# EAGLE board generation_board_v5 (EAGLE 8.4.2)
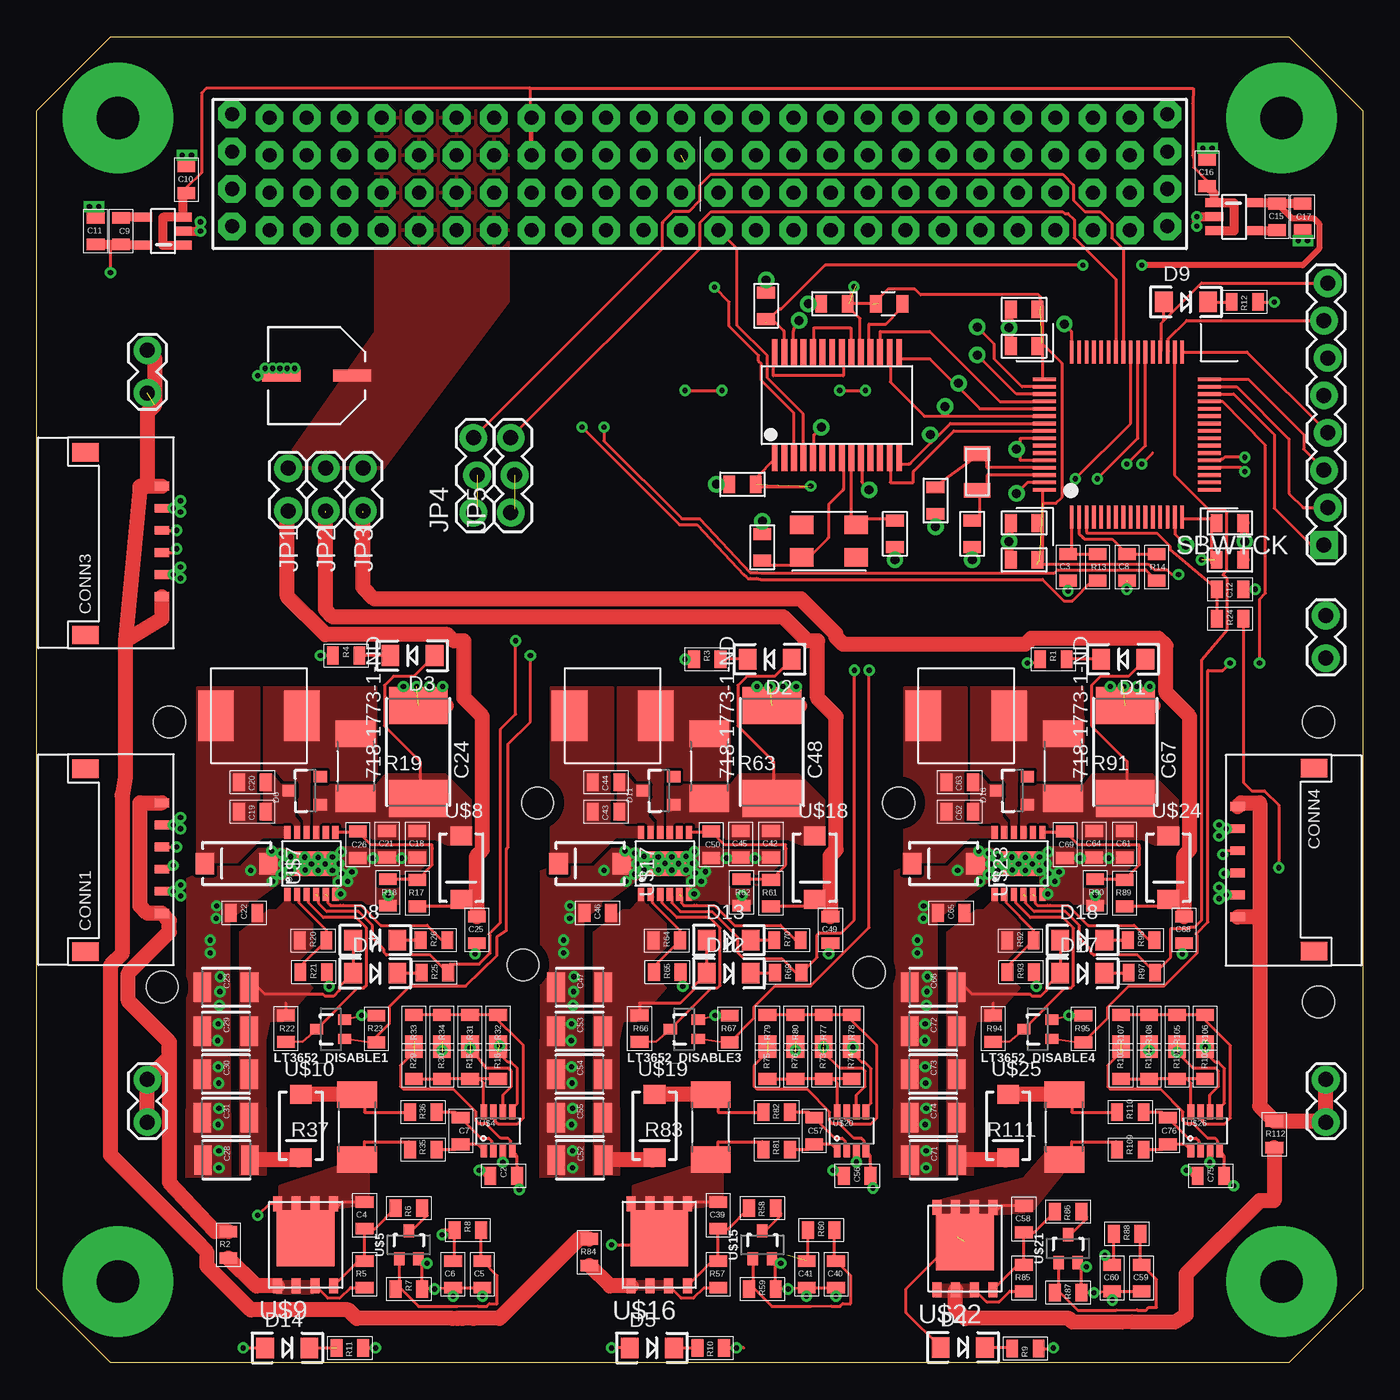
[diagram p2: board, top side]
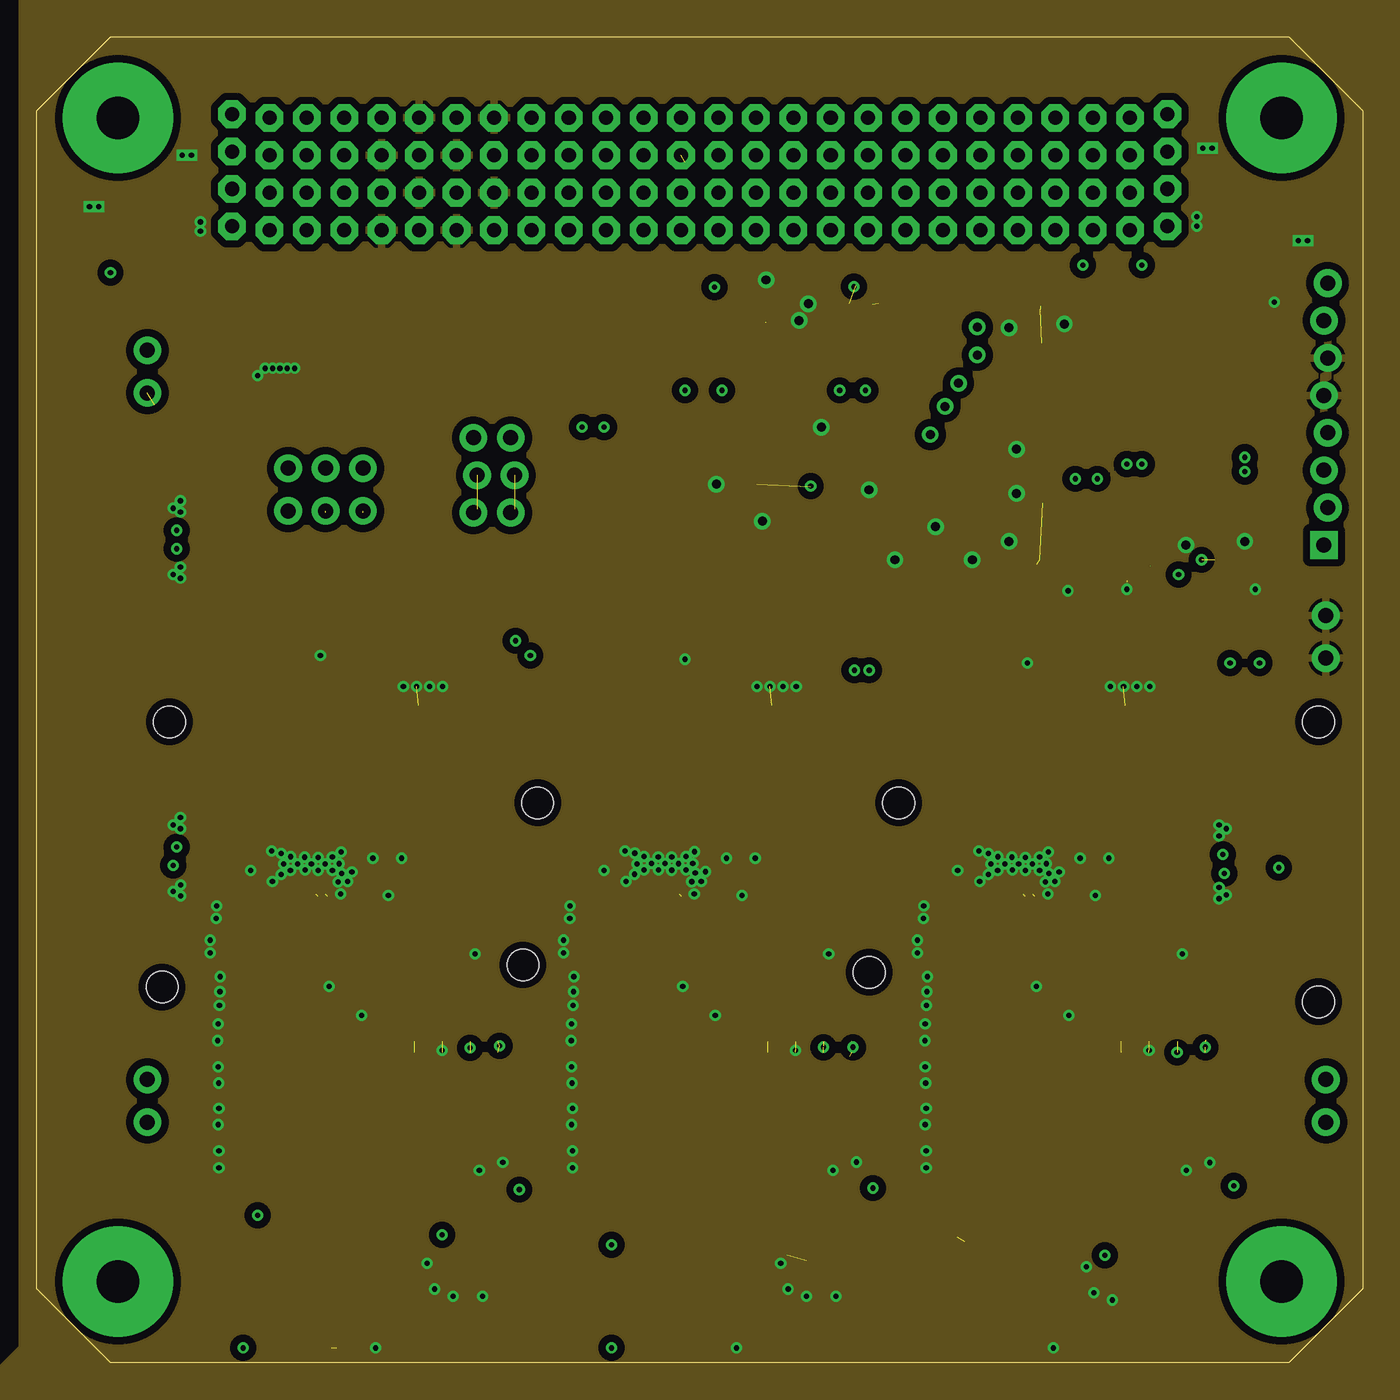
[diagram p3: board, inner layer GND2]
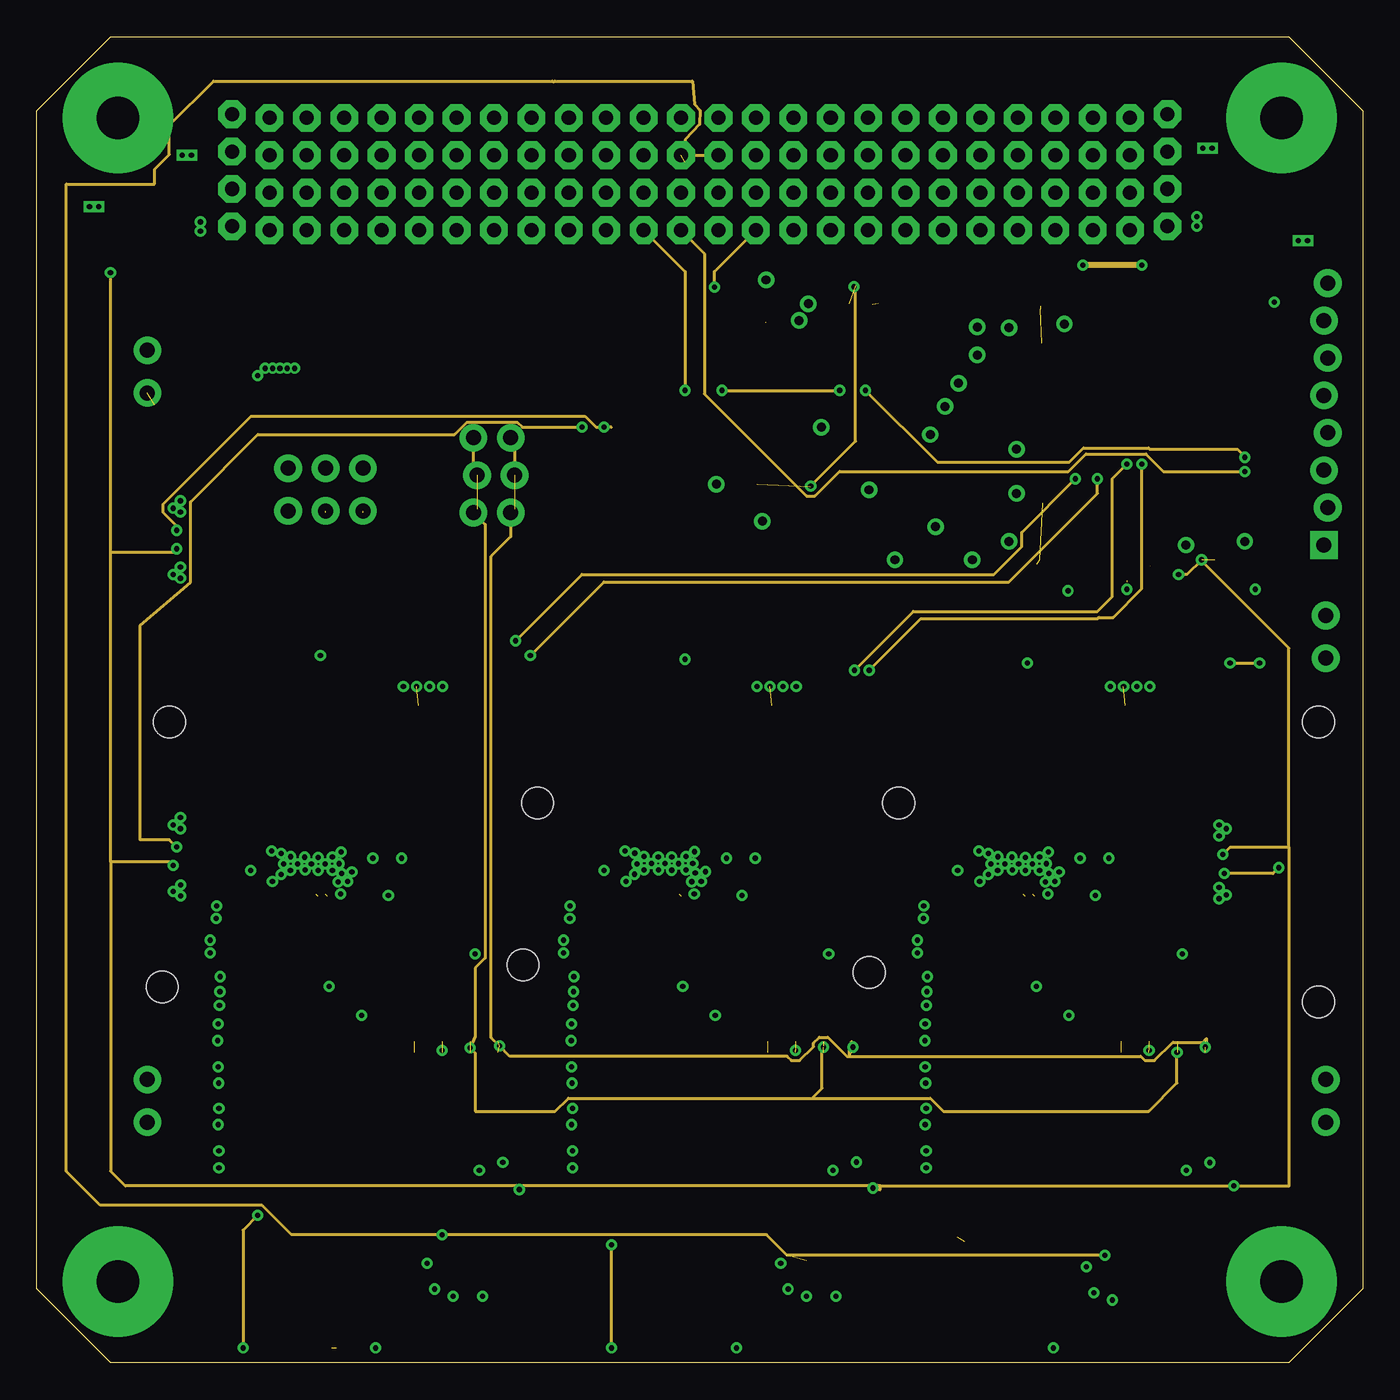
[diagram p4: board, inner layer Route3]
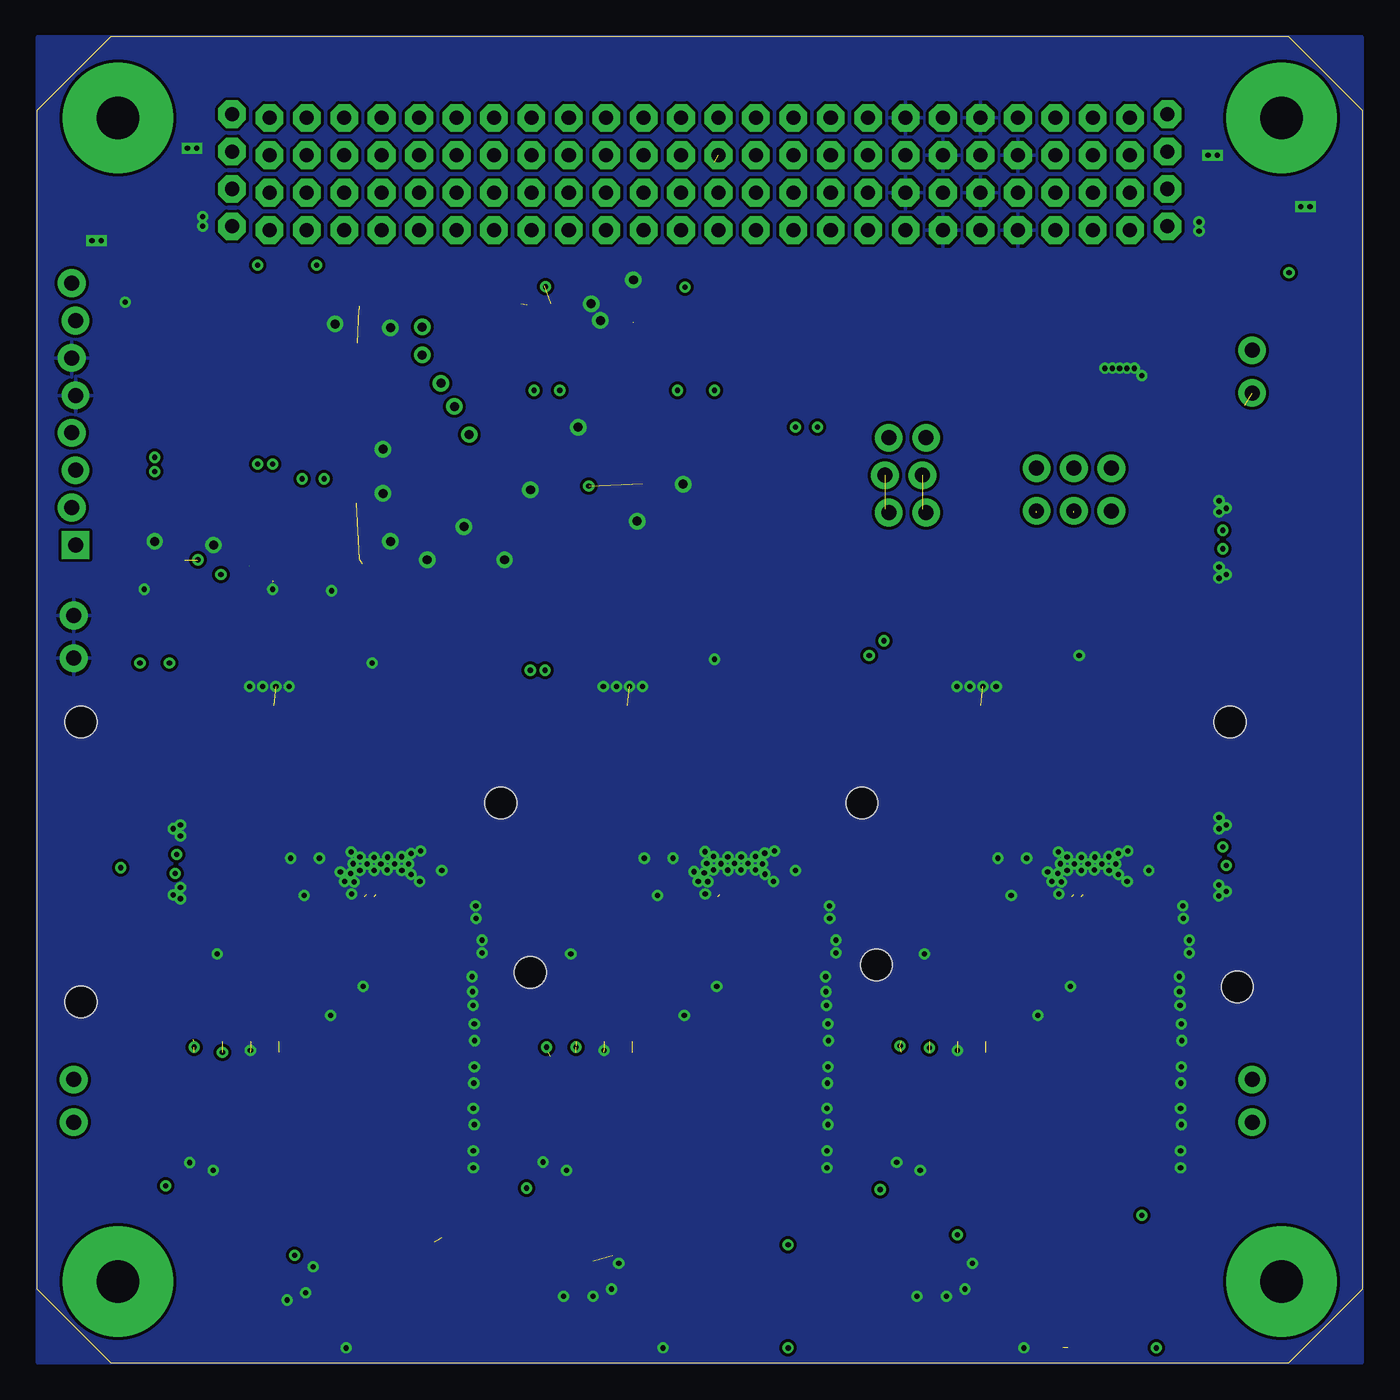
[diagram p5: board, bottom side, seen from below]

Size 90 x 90 mm. Coordinates in mm from the lower left corner, seen from the top.
Copper layers (1*2*3*16): Top 0.035mm / dielectric 1.5mm / GND2 0.035mm / dielectric 0.15mm / Route3 0.035mm / dielectric 0.2mm / GND 0.035mm
Design rules "default *": minimum track width 6mil, minimum drill 0.35mm, track to track 8mil, track to pad 8mil, pad to pad 8mil, via to via 8mil, smd to smd 0mil, copper to edge 0mil, drill to drill 6mil, minimum pad ring 10mil, minimum via ring 8mil, stop-mask expansion 4mil, vias tented up to drill 0mil, thermal gap 10mil
Net classes: 0 default: width 0.254 mm, drill 0.254 mm, clearance 0.152 mm

## Footprints (pad centres in the part's own frame; a part is rotated, then mirrored left to right if it is on the bottom)
MSP-CAN_BLOCK = smd 1.2 x 0.8: 1 -6,6.08; 2 -6,7.88; 3 -8.5,6.08; 4 -8.5,7.88; 9 -8.5,-6.08; 10 -8.5,-7.88; 11 -6,-6.08; 12 -6,-7.88; 13 8.5,6.08; 14 8.5,7.88; 15 6,6.08; 16 6,7.88; 23 8.875,18.955; 24 8.875,20.755; 25 8.875,17.045; 26 8.875,15.245; 27 -3.375,25.205; 28 -3.375,27.005 | smd 1 x 0.25: 3.3V@CAN1 -3.375,25.125; 3.3V@CAN2 8.875,18.875; 3.3V@MSP1 8.501,5.884; 3.3V@MSP2 -8.533,-5.962; 3.3V_ANALOG@MSP2 -8.482,5.904 | smd 0.8 x 1.2: 5 -5.83,10.5; 6 -7.63,10.5; 7 -3.58,13; 8 -5.38,13; 17 -8.545,24.75; 18 -6.745,24.75; 19 -5.83,15.75; 20 -7.63,15.75; 21 7.83,24.5; 22 9.63,24.5 | smd 0.25 x 1: 5V 7.65,24.5 | smd 1.75 x 0.4: CANH -1.6,21.96; CANL -1.6,22.61; P$65 -1.6,23.91; P$66 -1.6,23.26; P$69 -1.6,21.31; P$70 -1.6,20.66; P$71 -1.6,20.01; P$72 -1.6,19.36; P$73 -1.6,18.71; P$74 -1.6,18.06; P$75 -1.6,17.41; P$76 -1.6,16.76; P$77 -1.6,16.11; P$78 -1.6,15.46; P$79 5.6,15.46; P$80 5.6,16.11; P$81 5.6,16.76; P$82 5.6,17.41; P$83 5.6,18.06; P$84 5.6,18.71; P$85 5.6,19.36; P$86 5.6,20.01; P$87 5.6,20.66; P$88 5.6,21.31; P$89 5.6,21.96; P$90 5.6,22.61; P$91 5.6,23.26; P$92 5.6,23.91 | drill 0.61: GND@1 -3.375,27.875; GND@2 -5.875,24.75; GND@3 -3.75,17.5; GND@4 0.5,20.75; GND@5 -8.5,15.75; GND@7 -8.5,10.5; GND@8 -7.25,8; GND@9 -4,7.5; GND@10 -1,7.5; GND@11 7.75,22.25; GND@12 10.5,24.5; GND@13 8.875,21.625; GND@14 7.25,8; GND@15 7.5,4.25; GND@16 -7.5,-4; GND@17 -7.25,-8; GND@26 -6.25,13; P2.4_SPI-CS2 5.397,10.16; P2.7_SPI-CS3 7.303,10.16; P5.4_SPI-MOSI 3.487,11.434; P5.5_SPI-MISO 1.9,12.354; P5.6_SPI-CLK 0,13.348 | smd 1.55 x 0.25: P1.0_A0 -5.6,3.75; P1.1_A1 -5.6,3.25; P1.2_A2 -5.6,2.75; P1.3_A3 -5.6,-1.75; P1.4_A4 -5.6,-2.25; P1.5_A5 -5.6,-2.75; P1.6_GPIO/PWM 5.6,-0.75; P1.7_GPIO/PWM 5.6,-0.25; P2.1_RXD 5.6,-3.75; P2.2_GPIO/PWM 5.6,-3.25; P3.0_A12 -5.6,2.25; P3.1_A13 -5.6,1.75; P3.2_A14 -5.6,1.25; P3.3_A15 -5.6,0.75; P3.4_GPIO_DEBUG 5.6,-2.75; P3.5_GPIO_DEBUG 5.6,-2.25; P3.6_GPIO/PWM 5.6,-1.75; P3.7_GPIO/PWM 5.6,-1.25; P5.0_I2C-SDA-1 5.6,0.25; P5.1_I2C-SCL-1 5.6,0.75; P7.0_I2C-SDA-2 -5.6,-0.25; P7.1_I2C-SCL-2 -5.6,-0.75; P$8 -5.6,0.25; P$11 -5.6,-1.25; P$15 -5.6,-3.25; P$16 -5.6,-3.75; P$43 5.6,1.25; P$44 5.6,1.75; P$45 5.6,2.25; P$46 5.6,2.75; P$47 5.6,3.25; P$48 5.6,3.75 | smd 0.25 x 1.55: P2.0_TXD 3.75,-5.6; P2.5_GPIO 1.75,-5.6; P2.6_GPIO/PWM 2.25,-5.6; P4.0_GPIO -0.25,-5.6; P4.1_GPIO 0.25,-5.6; P4.2_GPIO 0.75,-5.6; P4.3_GPIO 1.25,-5.6; P7.2_SYNC1 -1.75,-5.6; P7.3_GPIO -1.25,-5.6; P7.4_GPIO -0.75,-5.6; P$17 -3.75,-5.6; P$18 -3.25,-5.6; P$19 -2.75,-5.6; P$49 3.75,5.6; P$50 3.25,5.6; P$51 2.75,5.6; P$52 2.25,5.6; P$53 1.75,5.6; P$54 1.25,5.6; P$55 0.75,5.6; P$56 0.25,5.6; P$57 -0.25,5.6; P$58 -0.75,5.6; P$59 -1.25,5.6; P$60 -1.75,5.6; P$61 -2.25,5.6; P$62 -2.75,5.6; P$63 -3.25,5.6; P$64 -3.75,5.6; PJ.3_SYNC2 -2.25,-5.6; SBWTCK 2.75,-5.6; SBWTDIO 3.25,-5.6 | smd 1 x 1.8: P$93 -3.79,10.16; P$94 -1.29,10.16 | smd 1.25 x 1.6: P$104 -6.13,18.38; P$105 -6.13,22.08; P$106 -8.33,22.08; P$107 -8.33,18.38
PANASONIC_SVPG = smd 0.8 x 2.6: NEG 0,2.4; POS 0,-2.4
0805 = smd 0.8 x 1.2: 1 -0.9,0; 2 0.9,0
1210 = smd 1.2 x 2: 1 -1.6,0; 2 1.6,0
2917 = smd 2.5 x 4: 1 -3.15,0; 2 3.15,0
PICOLOCK_6 = smd 1.25 x 1.8: MNT@1 -2.605,5.2; MNT@2 9.805,5.2 | smd 0.6 x 1: P$1 0,0; P$2 1.5,0; P$3 3,0; P$4 4.5,0; P$5 6,0; P$6 7.5,0
LED-1206 = smd 1.2 x 1.4: A -1.5,0; C 1.5,0
SOT23-3 = smd 0.8 x 0.9: 1 -0.95,-1; 2 0.95,-1; 3 0,1.1
1X02_LOCK = drill 1.016 pad 1.88: 1 -0.178,0; 2 2.718,0
1X03_LOCK = drill 1.016 pad 1.88: 1 0,0.127; 2 2.54,-0.127; 3 5.08,0.127
VISHAY_SERIES_01 = smd 2.413 x 3.429: P$1 -2.921,0; P$2 2.921,0
SOT-323 = smd 0.7 x 0.9: 1 -0.65,-0.95; 2 0.65,-0.95; 3 0,0.95
R2010 = smd 1.8 x 2.7: 1 -2.2,0; 2 2.2,0
MSOP-12_GND = smd 0.889 x 0.42: 1 -2.1,1.625; 2 -2.1,0.975; 3 -2.1,0.325; 4 -2.1,-0.325; 5 -2.1,-0.975; 6 -2.1,-1.625; 7 2.1,-1.625; 8 2.1,-0.975; 9 2.1,-0.325; 10 2.1,0.325; 11 2.1,0.975; 12 2.1,1.625 | smd 1.651 x 2.845: 13 0,0
SOT-23-5 = smd 0.6 x 1.2: P$1 -0.95,-1.35; P$2 0,-1.35; P$3 0.95,-1.35; P$4 0.95,1.35; P$5 -0.95,1.35
PC104_CONNECTOR = drill 0.953 pad 1.88 octagon: P$1 -31.75,32.134; P$2 -31.75,34.674; P$3 -31.75,37.214; P$4 -31.75,39.754; P$5 -29.21,31.88; P$6 -29.21,34.42; P$7 -29.21,36.96; P$8 -29.21,39.5; P$9 -26.67,31.88; P$10 -26.67,34.42; P$11 -26.67,36.96; P$12 -26.67,39.5; P$13 -24.13,31.88; P$14 -24.13,34.42; P$15 -24.13,36.96; P$16 -24.13,39.5; P$17 -21.59,31.88; P$18 -21.59,34.42; P$19 -21.59,36.96; P$20 -21.59,39.5; P$21 -19.05,31.88; P$22 -19.05,34.42; P$23 -19.05,36.96; P$24 -19.05,39.5; P$25 -16.51,31.88; P$26 -16.51,34.42; P$27 -16.51,36.96; P$28 -16.51,39.5; P$29 -13.97,31.88; P$30 -13.97,34.42; P$31 -13.97,36.96; P$32 -13.97,39.5; P$33 -11.43,31.88; P$34 -11.43,34.42; P$35 -11.43,36.96; P$36 -11.43,39.5; P$37 -8.89,31.88; P$38 -8.89,34.42; P$39 -8.89,36.96; P$40 -8.89,39.5; P$41 -6.35,31.88; P$42 -6.35,34.42; P$43 -6.35,36.96; P$44 -6.35,39.5; P$45 -3.81,31.88; P$46 -3.81,34.42; P$47 -3.81,36.96; P$48 -3.81,39.5; P$49 -1.27,31.88; P$50 -1.27,34.42; P$51 -1.27,36.96; P$52 -1.27,39.5; P$53 1.27,31.88; P$54 1.27,34.42; P$55 1.27,36.96; P$56 1.27,39.5; P$57 3.81,31.88; P$58 3.81,34.42; P$59 3.81,36.96; P$60 3.81,39.5; P$61 6.35,31.88; P$62 6.35,34.42; P$63 6.35,36.96; P$64 6.35,39.5; P$65 8.89,31.88; P$66 8.89,34.42; P$67 8.89,36.96; P$68 8.89,39.5; P$69 11.43,31.88; P$70 11.43,34.42; P$71 11.43,36.96; P$72 11.43,39.5; P$73 13.97,31.88; P$74 13.97,34.42; P$75 13.97,36.96; P$76 13.97,39.5; P$77 16.51,31.88; P$78 16.51,34.42; P$79 16.51,36.96; P$80 16.51,39.5; P$81 19.05,31.88; P$82 19.05,34.42; P$83 19.05,36.96; P$84 19.05,39.5; P$85 21.59,31.88; P$86 21.59,34.42; P$87 21.59,36.96; P$88 21.59,39.5; P$89 24.13,31.88; P$90 24.13,34.42; P$91 24.13,36.96; P$92 24.13,39.5; P$93 26.67,31.88; P$94 26.67,34.42; P$95 26.67,36.96; P$96 26.67,39.5; P$97 29.21,31.88; P$98 29.21,34.42; P$99 29.21,36.96; P$100 29.21,39.5; P$101 31.75,32.134; P$102 31.75,34.674; P$103 31.75,37.214; P$104 31.75,39.754
BOARD_TEMPLATE = drill 2.9 pad 7.5: P$1 -39.5,39.5; P$2 -39.5,-39.5; P$3 39.5,-39.5; P$4 39.5,39.5
1X08_CONNECTOR = drill 1.016 pad 1.88: 2 2.54,-0.127; 3 5.08,0.127; 4 7.62,-0.127; 5 10.16,0.127; 6 12.7,-0.127; 7 15.24,0.127; 8 17.78,-0.127 | drill 1.016 pad 1.88 square: SBWTCK 0,0.127
SOT-23-8 = smd 0.45 x 1: 1 -0.975,-1.3; 2 -0.325,-1.3; 3 0.325,-1.3; 4 0.975,-1.3; 5 0.975,1.3; 6 0.325,1.3; 7 -0.325,1.3; 8 -0.975,1.3
#2-56_BOLT_HOLE = hole 2.15: 0,0
SMA-DIODE = smd 1.27 x 1.47: A -2.15,0; C 2.15,0
POWERDI5060-8 = smd 3.91 x 3.81: D1 0,0.44 | smd 0.61 x 1.02: D2 -1.905,2.795; D3 -0.635,2.795; D4 0.635,2.795; D5 1.905,2.795; G 1.905,-2.795; S1 -1.905,-2.795; S2 -0.635,-2.795; S3 0.635,-2.795

## Placement (x,y rotation side)
BLK1  MSP-CAN_BLOCK  [MSP-CAN_BLOCK]  74,63 90 top
C1  270uF  [PANASONIC_SVPG]  19,67 90 top
C2  .1u  [0805]  31.69,12.68 180 top
C3  1u  [0805]  70,54 270 top
C4  .1u  [0805]  22.25,10 270 top
C5  DNP  [0805]  30.25,6 270 top
C6  DNP  [0805]  28.25,6 270 top
C7  1u  [0805]  28.77,15.73 90 top
C8  1u  [0805]  74,54 270 top
C9  0.01 μF  [0805]  5.71,76.8 90 top
C10  1 μF  [0805]  10.15,80.3 270 top
C11  1 μF  [0805]  3.99,76.8 270 top
C12  1u  [0805]  81,52.5 0 top
C15  0.01 μF  [0805]  84.2,77.78 270 top
C16  1 μF  [0805]  79.43,80.77 270 top
C17  1μF  [0805]  85.91,77.78 90 top
C18  10u  [0805]  25.84,35.2 270 top
C19  1u  [0805]  14.64,37.39 0 top
C20  10u, n/a  [0805]  14.64,39.39 0 top
C21  1u  [0805]  23.77,35.2 270 top
C22  1u  [0805]  14.07,30.53 180 top
C23  10u  [1210]  12.85,25.48 180 top
C24  718-1773-1-ND  [2917]  25.9,41.45 90 top
C25  10u  [0805]  29.87,29.38 270 top
C26  100pF\  [0805]  21.79,35.16 90 top
C28  10u  [1210]  12.87,13.76 180 top
C29  10u  [1210]  12.84,22.49 180 top
C30  10u  [1210]  12.84,19.58 180 top
C31  10u  [1210]  12.84,16.64 180 top
C39  .1u  [0805]  46.25,10 270 top
C40  DNP  [0805]  54.25,6 270 top
C41  DNP  [0805]  52.25,6 270 top
C42  10u  [0805]  49.84,35.2 270 top
C43  1u  [0805]  38.64,37.39 0 top
C44  10u, n/a  [0805]  38.64,39.39 0 top
C45  1u  [0805]  47.77,35.2 270 top
C46  1u  [0805]  38.07,30.53 180 top
C47  10u  [1210]  36.85,25.48 180 top
C48  718-1773-1-ND  [2917]  49.9,41.45 90 top
C49  10u  [0805]  53.87,29.38 270 top
C50  100pF\  [0805]  45.79,35.16 90 top
C52  10u  [1210]  36.87,13.76 180 top
C53  10u  [1210]  36.84,22.49 180 top
C54  10u  [1210]  36.84,19.58 180 top
C55  10u  [1210]  36.84,16.64 180 top
C56  .1u  [0805]  55.69,12.68 180 top
C57  1u  [0805]  52.77,15.73 90 top
C58  .1u  [0805]  67,9.75 270 top
C59  DNP  [0805]  75,5.75 270 top
C60  DNP  [0805]  73,5.75 270 top
C61  10u  [0805]  73.84,35.2 270 top
C62  1u  [0805]  62.64,37.39 0 top
C63  10u, n/a  [0805]  62.64,39.39 0 top
C64  1u  [0805]  71.78,35.2 270 top
C65  1u  [0805]  62.07,30.53 180 top
C66  10u  [1210]  60.85,25.48 180 top
C67  718-1773-1-ND  [2917]  73.9,41.45 90 top
C68  10u  [0805]  77.87,29.38 270 top
C69  100pF\  [0805]  69.79,35.16 90 top
C71  10u  [1210]  60.87,13.76 180 top
C72  10u  [1210]  60.84,22.49 180 top
C73  10u  [1210]  60.84,19.58 180 top
C74  10u  [1210]  60.84,16.64 180 top
C75  .1u  [0805]  79.69,12.68 180 top
C76  1u  [0805]  76.77,15.73 90 top
CONN1  PICOLOCK_6  [PICOLOCK_6]  8.5,30.5 90 top
CONN3  PICOLOCK_6  [PICOLOCK_6]  8.5,52 90 top
CONN4  PICOLOCK_6  [PICOLOCK_6]  81.5,37.75 270 top
D1  [LED-1206]  73.75,47.75 180 top
D2  [LED-1206]  49.75,47.75 180 top
D3  [LED-1206]  25.5,48 180 top
D4  [LED-1206]  62.86,1.04 0 top
D5  [LED-1206]  41.75,1 0 top
D6  CMPSH1-4  [SOT23-3]  18.24,38.83 90 top
D7  [LED-1206]  22.97,26.43 0 top
D8  [LED-1206]  22.97,28.68 0 top
D9  [LED-1206]  78,72 0 top
D11  CMPSH1-4  [SOT23-3]  42.24,38.83 90 top
D12  [LED-1206]  46.97,26.43 0 top
D13  [LED-1206]  46.97,28.68 0 top
D14  [LED-1206]  17,1 0 top
D16  CMPSH1-4  [SOT23-3]  66.24,38.83 90 top
D17  [LED-1206]  70.97,26.43 0 top
D18  [LED-1206]  70.97,28.68 0 top
JP1  M02LOCK  [1X02_LOCK]  17.06,58 90 top
JP2  M02LOCK  [1X02_LOCK]  19.6,58 90 top
JP3  M02LOCK  [1X02_LOCK]  22.14,58 90 top
JP4  [1X03_LOCK]  29.76,57.7 90 top
JP5  [1X03_LOCK]  32.3,57.7 90 top
JP6  M02LOCK  [1X02_LOCK]  7.5,66 90 top
JP7  M02LOCK  [1X02_LOCK]  7.5,16.5 90 top
JP8  M02LOCK  [1X02_LOCK]  87.5,16.5 90 top
JP9  M02LOCK  [1X02_LOCK]  87.5,48 90 top
L2  10uH  [VISHAY_SERIES_01]  15.08,43.91 0 top
L3  10uH  [VISHAY_SERIES_01]  39.08,43.91 0 top
L4  10uH  [VISHAY_SERIES_01]  63.08,43.91 0 top
LT3652_DISABLE1  DMN5L06WK  [SOT-323]  19.95,22.63 90 top
LT3652_DISABLE3  DMN5L06WK  [SOT-323]  43.95,22.63 90 top
LT3652_DISABLE4  DMN5L06WK  [SOT-323]  67.95,22.63 90 top
R1  5k  [0805]  69,47.75 180 top
R2  0  [0805]  13,8 270 top
R3  5k  [0805]  45.5,47.75 180 top
R4  5k  [0805]  21,48 180 top
R5  1M  [0805]  22.25,6 270 top
R6  20k  [0805]  25.25,10.5 0 top
R7  100k  [0805]  25.25,5 180 top
R8  0  [0805]  29.25,9 180 top
R9  5k  [0805]  67.11,0.96 0 top
R10  5k  [0805]  45.75,1 0 top
R11  5k  [0805]  21.25,1 0 top
R12  500  [0805]  82,72 0 top
R13  1k  [0805]  72,54 90 top
R14  1k  [0805]  76,54 90 top
R15  DNP  [0805]  29.41,20.18 90 top
R16  DNP  [0805]  31.31,20.18 90 top
R17  523k  [0805]  25.83,31.87 270 top
R18  464k  [0805]  23.83,31.92 90 top
R19  .09  [R2010]  21.65,40.5 270 top
R20  604k  [0805]  18.76,28.66 180 top
R21  143k  [0805]  18.79,26.51 180 top
R22  100k  [0805]  16.91,22.68 90 top
R23  100k  [0805]  23.04,22.65 270 top
R24  1k  [0805]  81,50.5 180 top
R25  1.3k  [0805]  27.01,26.47 180 top
R26  1.3k  [0805]  26.96,28.69 180 top
R29  DNP  [0805]  25.59,20.18 90 top
R30  0  [0805]  27.5,20.18 90 top
R31  0  [0805]  29.41,22.71 270 top
R32  DNP  [0805]  31.31,22.71 270 top
R33  DNP  [0805]  25.59,22.71 270 top
R34  DNP  [0805]  27.5,22.71 270 top
R35  10  [0805]  26.23,14.46 180 top
R36  10  [0805]  26.23,17 180 top
R37  .1  [R2010]  21.75,16 90 top
R57  1M  [0805]  46.25,6 270 top
R58  20k  [0805]  49.25,10.5 0 top
R59  100k  [0805]  49.25,5 180 top
R60  0  [0805]  53.25,9 180 top
R61  523k  [0805]  49.83,31.87 270 top
R62  464k  [0805]  47.83,31.92 90 top
R63  .11  [R2010]  45.65,40.5 270 top
R64  604k  [0805]  42.76,28.66 180 top
R65  182k  [0805]  42.79,26.51 180 top
R66  100k  [0805]  40.91,22.68 90 top
R67  100k  [0805]  47.04,22.65 270 top
R69  1.3k  [0805]  51.01,26.47 180 top
R70  1.3k  [0805]  50.96,28.69 180 top
R73  DNP  [0805]  53.41,20.18 90 top
R74  DNP  [0805]  55.31,20.18 90 top
R75  DNP  [0805]  49.59,20.18 90 top
R76  0  [0805]  51.5,20.18 90 top
R77  DNP  [0805]  53.41,22.71 270 top
R78  0  [0805]  55.31,22.71 270 top
R79  DNP  [0805]  49.59,22.71 270 top
R80  DNP  [0805]  51.5,22.71 270 top
R81  10  [0805]  50.23,14.46 180 top
R82  10  [0805]  50.23,17 180 top
R83  .1  [R2010]  45.75,16 90 top
R84  0  [0805]  37.5,7.5 270 top
R85  1M  [0805]  67,5.75 270 top
R86  20k  [0805]  70,10.25 0 top
R87  100k  [0805]  70,4.75 180 top
R88  0  [0805]  74,8.75 180 top
R89  523k  [0805]  73.83,31.87 270 top
R90  464k  [0805]  71.83,31.92 90 top
R91  .09  [R2010]  69.65,40.5 270 top
R92  604k  [0805]  66.76,28.66 180 top
R93  143k  [0805]  66.79,26.51 180 top
R94  100k  [0805]  64.91,22.68 90 top
R95  100k  [0805]  71.04,22.65 270 top
R97  1.3k  [0805]  75.01,26.47 180 top
R98  1.3k  [0805]  74.96,28.69 180 top
R101  DNP  [0805]  77.41,20.18 90 top
R102  DNP  [0805]  79.31,20.18 90 top
R103  0  [0805]  73.59,20.18 90 top
R104  DNP  [0805]  75.5,20.18 90 top
R105  DNP  [0805]  77.41,22.71 270 top
R106  DNP  [0805]  79.31,22.71 270 top
R107  DNP  [0805]  73.59,22.71 270 top
R108  0  [0805]  75.5,22.71 270 top
R109  10  [0805]  74.23,14.46 180 top
R110  10  [0805]  74.23,17 180 top
R111  .1  [R2010]  69.75,16 90 top
R112  0  [0805]  84,15.5 270 top
U2  LT3652  [MSOP-12_GND]  18.64,33.88 90 top
U3  LT3652  [MSOP-12_GND]  42.64,33.88 90 top
U4  LT3652  [MSOP-12_GND]  66.64,33.88 90 top
U5  TPS732XX  [SOT-23-5]  8.56,76.8 90 top
U7  TPS732XX  [SOT-23-5]  81.28,77.78 270 top
U$1  PC104_CONNECTOR  [PC104_CONNECTOR]  45,45 0 top
U$2  BOARD_TEMPLATE1  [BOARD_TEMPLATE]  45,45 0 top
U$3  PROGRAM/DEBUG_PORT  [1X08_CONNECTOR]  87.5,55.5 90 top
U$4  INA219  [SOT-23-8]  31.31,15.73 0 top
U$5  DMN5L06WK  [SOT-323]  25.25,8 0 top
U$6  [#2-56_BOLT_HOLE]  34,38 0 top
U$7  CMSH3-40MA  [SMA-DIODE]  13.56,33.88 180 top
U$8  CMSH3-40MA  [SMA-DIODE]  28.81,33.6 270 top
U$9  DMP2002UPS  [POWERDI5060-8]  18.25,8 0 top
U$10  CMSH3-40MA  [SMA-DIODE]  17.93,16.07 270 top
U$11  [#2-56_BOLT_HOLE]  9,43.5 0 top
U$12  [#2-56_BOLT_HOLE]  8.5,25.5 0 top
U$13  [#2-56_BOLT_HOLE]  33,27 0 top
U$14  [#2-56_BOLT_HOLE]  56.5,26.5 0 top
U$15  DMN5L06WK  [SOT-323]  49.25,8 0 top
U$16  DMP2002UPS  [POWERDI5060-8]  42.25,8 0 top
U$17  CMSH3-40MA  [SMA-DIODE]  37.56,33.88 180 top
U$18  CMSH3-40MA  [SMA-DIODE]  52.81,33.6 270 top
U$19  CMSH3-40MA  [SMA-DIODE]  41.93,16.07 270 top
U$20  INA219  [SOT-23-8]  55.31,15.73 0 top
U$21  DMN5L06WK  [SOT-323]  70,7.75 0 top
U$22  DMP2002UPS  [POWERDI5060-8]  63,7.75 0 top
U$23  CMSH3-40MA  [SMA-DIODE]  61.56,33.88 180 top
U$24  CMSH3-40MA  [SMA-DIODE]  76.81,33.6 270 top
U$25  CMSH3-40MA  [SMA-DIODE]  65.93,16.07 270 top
U$26  INA219  [SOT-23-8]  79.31,15.73 0 top
U$27  [#2-56_BOLT_HOLE]  58.5,38 0 top
U$28  [#2-56_BOLT_HOLE]  87,24.5 0 top
U$29  [#2-56_BOLT_HOLE]  87,43.5 0 top

## Tracks (layer width: path | path; a pad name or v marks a point on that pad's centre or on a via)
3.3V  (via drill 0.35)  (12 unrouted)
  Top 0.203: R29.2 24.69,20.17 24.69,18.75 24.87,18.57 28.26,18.57 29.8,17.03 29.8,16.4 29.98,16.23 30.49,16.23 31.48,15.23 31.99,15.23 32.16,15.06 32.16,14.55 U$4.4 32.56,14.05 C2.1 32.75,12.52 v32.75,11.75 | R75.2 48.69,20.17 48.69,18.75 48.87,18.57 52.26,18.57 53.8,17.03 53.8,16.4 53.98,16.23 54.49,16.23 55.48,15.23 55.99,15.23 56.16,15.06 56.16,14.55 U$20.4 56.56,14.05 C56.1 56.75,12.52 v56.75,11.85 | R103.2 72.69,20.17 72.69,18.75 72.87,18.57 76.26,18.57 77.81,17.03 77.81,16.4 77.98,16.23 78.49,16.23 79.48,15.23 79.99,15.23 80.16,15.06 80.16,14.55 U$26.4 80.56,14.05 C75.1 81.25,12.02 v81.25,12 | CONN4.P$3 80.5,34.75 v80.5,34.5 | v5,74 5,75.9 | CONN3.P$3 9.5,55 v9.5,55.25 | CONN1.P$3 9.25,33.5 v9.25,33.75 | 75.59,54.09 75.87,53.8 76.73,53.8 77.03,53.5 v77.5,53.5 | 67.89,54.21 75.4,54.21 75.59,54.08 | 68.3,58.35 69.19,58.35 69.6,58.76 69.6,67.83 68.22,69.21 | 68.13,71.72 68.13,72.36 68,72.49 59.99,72.49 59.6,72.88 57.78,72.88 56.73,71.83
  Top 0.61: C11.2 5,75.9 C9.1 5.76,75.85 U5.P$5
  Route3 0.203: v80.5,34.5 81,35 85,35 | 85,35 85,12 v81.25,12 57.25,12 | 5,34 5,55 | 5,34 5,13 6,12 33,12 | 5,55 v5,74 | 57.25,12 33,12 | v9.5,55.25 9.25,55 5,55 | v9.25,33.75 9,34 5,34 | v32.75,11.75 33,12 | v56.75,11.85 57.25,11.75 57.25,12 | 85,35 85,48.5 79,54.5 v79.07,54.5 78.07,53.5 v77.5,53.5 | 52.5,59.48 v52.53,59.51 55.57,62.55 55.57,73.1
5V  (via drill 0.35)  (1 unrouted)
  Top 0.203: v71,74.5 53.5,74.5 50.5,71.5 50.38,71.5 49.48,70.6
  Top 0.406: C15.1 85.19,77.69 86.68,77.69 87.04,77.33 87.04,75.61 85.93,74.5 v75,74.5
  Top 0.61: 85.91,78.73 C17.2 C15.1 84.15,78.73 U7.P$5
  Route3 0.406: v75,74.5 v71,74.5
BAT1
  Top 0.203: D3.A 25.59,46.59 24.2,46.59 23.59,45.98 23.59,43.22 26,40.82 26,38
  Top 0.406: 18.96,37.6 D6.1 | 21.23,37.88 R19.2
  Top 1.016: C24.1 27.53,38.3
  pour Top (rank 3, no thermals): 18.82,35.55 18.83,38.35 18.83,39.25 23.15,39.25 23.7,39.95 27.7,39.95 29.5,38.15 29.5,35.15 27.9,35.15 27.1,35.5
BAT2
  Top 0.203: D2.A 50.09,46.59 48.2,46.59 47.59,45.98 47.59,43.22 50,40.82 50,38.3
  Top 0.406: 42.97,37.6 D11.1 | 45.23,37.88 R63.2
  Top 1.016: 51.53,38.3 50,38.3 C48.1
  pour Top (rank 3, no thermals): 42.82,35.55 42.83,38.35 42.83,39.25 47.15,39.25 47.7,39.95 51.7,39.95 53.5,38.15 53.5,35.15 51.9,35.15 51.1,35.5
BAT3
  Top 0.203: D1.A 74.09,46.59 72.2,46.59 71.59,45.98 71.59,43.22 74,40.82 74,39
  Top 0.406: 66.97,37.6 D16.1 | 69.23,37.88 R91.2
  Top 1.016: 75.53,38.3 C67.1
  pour Top (rank 3, no thermals): 66.82,35.55 66.83,38.35 66.83,39.25 71.15,39.25 71.7,39.95 75.7,39.95 77.5,38.15 77.5,35.15 75.9,35.15 75.1,35.5
BOOST1
  pour Top (rank 5, no thermals): 17.52,36.45 15.95,36.45 15.3,36.85 15.3,40 15.95,40 16.55,39.3 17.5,39.3 17.5,38.35 17.5,37.69 17.5,37.09 17.85,36.68 17.85,36.15
BOOST2
  pour Top (rank 5, no thermals): 41.52,36.45 39.95,36.45 39.3,36.85 39.3,40 39.95,40 40.55,39.3 41.5,39.3 41.5,38.35 41.5,37.69 41.5,37.09 41.85,36.68 41.85,36.15
BOOST3
  pour Top (rank 5, no thermals): 65.52,36.45 63.95,36.45 63.3,36.85 63.3,40 63.95,40 64.55,39.3 65.5,39.3 65.5,38.35 65.5,37.69 65.5,37.09 65.85,36.68 65.85,36.15
CANH
  Top 0.203: BLK1.CANH 52.04,64.39 49.59,66.84 49.59,68.36 47.54,70.4 47.54,75.61 U$1.P$53
CANL  (via drill 0.35)
  Top 0.203: BLK1.CANL 51.39,64.46 49.18,66.67 49.18,67.82 49,68 49,68.36 47,70.36 47,72 v46,73
  Route3 0.203: v46,73 46,74.07 U$1.P$57
CHRG1  (via drill 0.35)  (1 unrouted)
  Top 0.203: 19.1,31.64 19.1,31.21 19.68,30.62 21.83,30.62 22.78,29.68 22.78,28.83 23.57,28.05 23.57,27.85 23.74,27.68 26.7,27.68 R25.1 28.02,27.07 30.03,27.07 30.77,27.81 30.77,29.01 30.69,29.09 30.77,29.17 31.48,29.88 31.48,43 32.5,44.02 v32.5,49 | v70.5,60 74.25,63.75 BLK1.P1.7_GPIO/PWM
  Route3 0.203: v32.5,49 37,53.5 64.97,53.5 66.86,55.39 66.86,56.36 v70.5,60
CHRG2  (via drill 0.35)
  Top 0.203: U3.4 43.1,31.64 43.1,31.21 43.69,30.62 45.83,30.62 47.56,28.89 47.56,27.85 47.98,27.43 50.58,27.43 51.54,26.47 R69.1 52.97,27.52 52.97,29.01 53.14,29.19 54.62,29.19 55.5,30.06 v55.5,47 | v74,61 75.25,62.25 BLK1.P3.7_GPIO/PWM
  Route3 0.203: v55.5,47 59.5,51 72,51 73,52 73,60 v74,61
CHRG3  (1 unrouted)
  Top 0.203: 67.1,31.64 67.1,31.21 67.69,30.62 69.83,30.62 70.78,29.68 70.78,28.83 71.56,28.05 71.56,27.85 71.74,27.68 74.7,27.68 R97.1 76.97,27.52 76.97,29.46 77.54,29.46 78.21,29.47 78.32,29.57 78.6,29.57 79.07,30.05 79.07,47.72 80.81,49.77 80.81,53.23 80.63,53.41 80.52,53.49 80.61,53.59 80.78,53.77 80.78,57.73 80.61,57.91 79.55,57.91 77.25,60.21 BLK1.P2.2_GPIO/PWM
DEPLOY_EN  (via drill 0.35)  (2 unrouted)
  Top 0.203: C6.1 28.35,7 R8.2 27.5,9 v27.5,8.68 | C41.1 52.35,7 R60.2 | R88.2 73.1,6.9 73,6.8 C60.1 72.5,7.15 v72.5,7.3 72.5,7.4
  Route3 0.203: v72.5,7.3 50.92,7.3 49.53,8.68 v27.5,8.68 17.28,8.68 15.28,10.68 4.32,10.68 2,13 2,80 8,80 8,81 9,82 9,84 12,87 35,87 35.08,86.92 35.15,87 44.5,87 44.66,85.42 45,85.01 44.98,84.05 44,83.01 44,81.5 44.46,81.96 U$1.P$55
DISABLE_PT1  (via drill 0.35)
  Top 0.152: R23.2 22.97,21.68 LT3652_DISABLE1.1
  Top 0.203: R23.2 23.04,22.12 23.95,23.02 23.95,24.17 25.34,25.57 29.11,25.57 31.24,27.64 31.23,28.89 31.88,29.34 31.88,34.88 32,35 32,42 33.5,43.5 v33.5,48 | v72,60 74.75,62.75 BLK1.P1.6_GPIO/PWM
  Route3 0.203: v33.5,48 38.5,53 66,53 72,59 v72,60
ENABLE_PT2  (via drill 0.35)
  Top 0.152: R67.2 46.97,21.68 LT3652_DISABLE3.1
  Top 0.203: R67.2 48.69,23.4 48.69,24.14 50.11,25.57 52.53,25.57 56.5,29.53 v56.5,47 | v75,61 75.75,61.75
  Route3 0.203: v56.5,47 60,50.5 72,50.5 72.09,50.59 73.06,50.59 75,52.53 v75,61
ENABLE_PT3  (via drill 0.35)
  Top 0.152: R95.2 70.97,21.68 LT3652_DISABLE4.1
  Top 0.203: R95.2 72.69,23.4 72.69,24.14 74.11,25.57 76.53,25.57 78.78,27.81 78.78,29.01 78.69,29.09 78.77,29.17 79.5,29.9 79.5,47 80.5,47 v81,47.5 | v83,47.5 83,51.83 83.41,52.24 83.41,62.27 80.5,65.24 79.67,65.24
  Route3 0.203: v81,47.5 v83,47.5
FAULT1  (1 unrouted)
  Top 0.203: 19.75,31.64 19.75,31.21 19.93,31.03 20.6,31.03 20.62,31.05 20.8,31.05 20.82,31.03 22,31.03 23.35,29.69 26.5,29.69 27.49,28.69 R26.1 28,28.69
FAULT2  (1 unrouted)
  Top 0.203: 43.75,31.64 43.75,31.21 43.93,31.03 44.6,31.03 44.62,31.05 44.8,31.05 44.82,31.03 46,31.03 47.35,29.69 50.5,29.69 51.49,28.69 R70.1 52,28.69
FAULT3  (1 unrouted)
  Top 0.203: 67.75,31.64 67.75,31.21 67.93,31.03 68.6,31.03 68.62,31.05 68.8,31.05 68.82,31.03 70,31.03 71.35,29.69 74.5,29.69 75.49,28.69 R98.1 76,28.69
GND  (via drill 0.35)  (10 unrouted)
  Top 0.152: R23.1 23.01,23.58 v22.05,23.58 LT3652_DISABLE1.2 | R21.1 19.8,26.4 19.8,25.6 v19.85,25.55 | R67.1 47.01,23.58 v46.05,23.58 LT3652_DISABLE3.2 | R65.1 43.8,26.4 43.8,25.6 v43.85,25.55 | R95.1 71.01,23.58 v70.05,23.58 LT3652_DISABLE4.2 | R93.1 67.8,26.4 67.8,25.6 v67.85,25.55
  Top 0.203: v28.25,4.5 C6.2 C5.2 | v30.25,4.5 C5.2 | v27,5 R7.1 | v26.5,6.75 26.2,7.05 U$5.2 26.15,6.8 R7.1 | C5.2 R7.1 | U$4.3 31.63,13.5 v31.64,13.59 | C2.2 30.42,12.68 v30.04,13.06 | v52.25,4.5 C41.2 C40.2 | v54.25,4.5 C40.2 | v51,5 R59.1 | v50.5,6.75 50.2,7.05 U$15.2 50.15,6.8 R59.1 | C40.2 R59.1 | U$20.3 55.63,13.5 v55.64,13.61 | C56.2 54.42,12.68 v54.04,13.06 | v73,4.25 C60.2 C59.2 R87.1 | v71.75,4.75 R87.1 | v71.25,6.5 70.95,6.8 U$21.2 70.9,6.55 R87.1 | U$26.3 79.63,13.5 v79.64,13.58 | C75.2 78.42,12.68 v78.04,13.06 | R1.2 67.85,47.5 v67.25,47.5 | R3.2 v44,47.75 43.75,47.75 | R4.2 v19.25,48 19,48 | C1.NEG v15,67 | R9.2 68.71,0.96 68.75,1 v69,1 | R11.2 v23,1 | R10.2 v47.5,1 48,1 | CONN1.P$2 v9.25,32 | CONN1.P$5 v9.25,36.5 | CONN3.P$2 v9.25,53.5 | CONN3.P$5 v9.25,58 | CONN4.P$2 v80.75,36.25 | CONN4.P$5 v80.75,31.75 | C25.2 30,28.35 30,27.75 v29.75,27.75 | C49.2 54,28.35 54,28 v53.75,27.75 | C68.2 77.87,27.87 v77.75,27.75 | R12.2 v84,72 | 74,53 v74,52.5 | C3.2 v70,52.4 | C12.2 v82.7,52.5 83,52.5
  Top 0.61: U5.P$2 v11.1,76.8 v11.1,77.44 | v3.58,78.48 3.99,78.06 C11.1 4.21,77.92 v4.21,78.48 | v9.86,81.97 9.86,81.48 C10.1 10.15,81.63 v10.5,81.97 | U7.P$2 v78.73,77.78 v78.73,77.15 | v85.62,76.16 85.91,76.45 C17.1 85.91,76.5 v86.26,76.16 | v79.14,82.44 79.14,82.01 C16.1 79.43,82.1 v79.78,82.44
  Top 1.016: C24.2 27.79,44.6 | C48.2 51.79,44.6 | C67.2 75.79,44.6
  other vias: 27.55,45.9 26.66,45.9 25.77,45.9 24.88,45.9 19.09,33.41 18.64,33.87 19.09,34.31 18.18,34.32 18.2,33.44 17.71,33.87 17.23,34.35 17.21,33.42 21.39,33.31 24.77,34.25 22.82,34.25 23.86,31.73 20.62,31.82 12.4,24.26 12.42,25.19 12.45,26.21 11.77,27.81 11.77,28.68 12.17,30.16 12.2,31 14.5,33.41 12.27,21.86 12.3,23 12.34,18.98 12.3,20.09 12.3,16.16 12.37,17.27 12.37,14.39 12.37,13.22 27.5,21.19 51.55,45.9 50.66,45.9 49.77,45.9 48.88,45.9 48.77,34.25 46.81,34.25 47.87,31.73 44.62,31.82 36.39,24.26 36.42,25.19 36.45,26.21 35.77,27.81 35.77,28.68 36.17,30.16 36.2,31 38.51,33.41 36.27,21.86 36.3,23 36.34,18.98 36.3,20.09 36.3,16.16 36.37,17.27 36.37,14.39 36.37,13.22 51.5,21.19 75.55,45.9 74.66,45.9 73.77,45.9 72.88,45.9 72.77,34.25 70.81,34.25 71.86,31.73 68.62,31.82 60.39,24.26 60.42,25.19 60.45,26.21 59.77,27.81 59.77,28.68 60.17,30.16 60.2,31 62.5,33.41 60.27,21.86 60.3,23 60.34,18.98 60.3,20.09 60.3,16.16 60.37,17.27 60.37,14.39 60.37,13.22 75.5,21.19 15.5,67.5 16,67.5 16.5,67.5 17,67.5 17.5,67.5 9.77,32.43 9.77,31.68 9.75,37 9.75,36.25 9.75,58.5 9.75,57.75 9.75,54 9.75,53.25 80.25,32.25 80.25,31.5 80.25,35.75 80.25,36.5 19.57,33.86 20.07,34.34 20.07,33.42 20.52,33.88 16.75,33.85 16.59,34.57 16.57,33.14 16,32.66 20.64,34.67 20.7,33.22 20.45,32.63 21.11,32.66 15.93,34.73 43.09,33.43 42.63,33.89 43.09,34.33 42.19,34.34 42.2,33.46 41.72,33.89 41.23,34.37 41.22,33.44 45.38,33.33 43.56,33.88 44.06,34.36 44.06,33.44 44.52,33.9 40.74,33.87 40.59,34.59 40.58,33.16 39.99,32.68 44.65,34.69 44.7,33.24 44.45,32.65 45.1,32.68 39.94,34.75 67.11,33.41 66.64,33.87 67.11,34.31 66.19,34.32 66.22,33.44 65.72,33.87 65.23,34.35 65.22,33.42 69.39,33.31 67.58,33.86 68.08,34.34 68.08,33.42 68.53,33.88 64.75,33.85 64.59,34.57 64.59,33.14 64,32.66 68.66,34.67 68.7,33.22 68.47,32.63 69.11,32.66 63.95,34.73
  pour Top (rank 3, no thermals): 10.2,31.4 10.2,32.9 14.5,34.95 16.9,34.95 17.2,34.65 20.1,34.65 20.6,35.05 26.5,35.05 26.5,32.4 24.6,32.4 24.55,31.1 20.1,31.05 20.1,33.1 17.25,33.1 13.1,30.1 13.15,12.6 10.15,12.55
  pour GND: 0,90 90,90 90,0 0,0
  pour Top (rank 3, no thermals): 34.2,31.4 34.2,33.4 38.5,34.95 40.9,34.95 41.2,34.65 44.1,34.65 44.6,35.05 50.5,35.05 50.5,32.4 48.6,32.4 48.55,31.1 44.1,31.05 44.1,33.1 41.25,33.1 37.1,30.1 37.15,12.6 34.15,12.55
  pour Top (rank 3, no thermals): 58.2,31.4 58.2,33.4 62.5,34.95 64.9,34.95 65.2,34.65 68.1,34.65 68.6,35.05 74.5,35.05 74.5,32.4 72.6,32.4 72.55,31.1 68.1,31.05 68.1,33.1 65.25,33.1 61.1,30.1 61.15,12.6 58.15,12.55
  pour GND2 (isolate 0.5): -1,93 93,93 93,-4 -6,-4 -1,1
IN1
  Top 0.203: U$9.S3 18.91,5.2 19.72,4.39 20.59,4.39 21.3,5.1 R5.2
  Top 1.016: U$9.S1 14.89,5.2 R2.2
  pour Top (no thermals): 16.25,5.5 16.25,4.75 18.75,4.75 18.75,5.5
IN2
  Top 0.203: U$16.S3 42.91,5.2 43.72,4.39 44.59,4.39 45.3,5.1 R57.2
  Top 1.016: U$16.S1 38.89,5.2 R84.2
  pour Top (no thermals): 40.25,5.5 40.25,5 42.75,5 42.75,5.5
IN3
  Top 0.203: U$22.S3 63.66,4.95 64.47,4.14 65.34,4.14 66.05,4.85 R85.2
  Top 1.016: R112.2 84,11 83,11 78,6 78,3.25 77.25,2.75 74.38,2.75 74.36,2.77 73.62,2.75 73.29,2.75 72.97,2.75 72.96,2.75 70.31,2.75 70.07,3 63,3 62.36,3.63 U$22.S2
  pour Top (no thermals): 61,5.25 61,4.5 63.5,4.5 63.5,5.25
INA219_A0_1
  Top 0.203: U$4.7 31.11,16.91 31.11,16.4 31.28,16.23 32.64,16.23 33.03,16.62 33.03,21.53 30.94,23.61 | 30.94,23.61 R31.1 R34.1 R33.1 | 30.94,23.61 R32.1
INA219_A0_2
  Top 0.203: U$20.7 55.11,16.91 55.11,16.4 55.28,16.23 56.64,16.23 57.03,16.62 57.03,21.53 54.94,23.61 | 54.94,23.61 R77.1 R80.1 R79.1 | 54.94,23.61 R78.1
INA219_A0_3
  Top 0.203: U$26.7 79.1,16.91 79.1,16.4 79.28,16.23 80.64,16.23 81.03,16.62 81.03,21.53 78.94,23.61 | 78.94,23.61 R105.1 R108.1 R107.1 | 78.94,23.61 R106.1
INA219_A1_1
  Top 0.203: R29.1 R30.1 R15.1 30.04,19.27 | R16.1 30.04,19.27 | U$4.8 30.34,18.98 30.04,19.27
INA219_A1_2
  Top 0.203: R75.1 R76.1 R73.1 54.04,19.27 | R74.1 54.04,19.27 | U$20.8 54.34,18.98 54.04,19.27
INA219_A1_3
  Top 0.203: R103.1 R104.1 R101.1 78.04,19.27 | R102.1 78.04,19.27 | U$26.8 78.34,18.98 78.04,19.27
INA219_IN+_1
  Top 0.203: U$4.1 29.94,14.83 C7.1 28.4,14.46 R35.1
INA219_IN+_2
  Top 0.203: U$20.1 53.94,14.83 C57.1 52.4,14.46 R81.1
INA219_IN+_3
  Top 0.203: U$26.1 77.94,14.83 C76.1 76.4,14.46 R109.1
INA219_IN-_1
  Top 0.203: 28.77,16.36 C7.2 | C7.2 28.4,17 R36.1 | C7.2 30.16,15.23 30.69,15.23 30.87,15.06 30.87,14.55 U$4.2
INA219_IN-_2
  Top 0.203: 52.77,16.36 C57.2 | C57.2 52.4,17 R82.1 | C57.2 54.16,15.23 54.69,15.23 54.87,15.06 54.87,14.55 U$20.2
INA219_IN-_3
  Top 0.203: 76.77,16.36 C76.2 | C76.2 76.4,17 R110.1 | C76.2 78.16,15.23 78.69,15.23 78.87,15.06 78.87,14.55 U$26.2
INPUT_PANEL1
  Top 1.016: R2.1 12.1,8.9 9,12.25 9,21.77 | CONN1.P$6 7,38 7,31 7.5,30.5 CONN1.P$1 9,30 9,29.23 6.21,26.45 6.21,24.55 9,21.77 | JP7.1 JP7.2 9,20.72 9,21.77
INPUT_PANEL2  (1 unrouted)
  Top 1.016: 6,49 8.5,50.5 CONN3.P$1 | R84.1 36.8,8.4 31.4,3 29.63,3 29.61,3.02 28.87,3 28.54,3 28.22,3 28.21,3 21.72,3 21.15,3.58 14.52,3.58 11.55,6.55 11.55,7.48 10.69,8.4 4.99,14.1 4.99,26.95 5.78,27.74 5.78,38.51 6,39.72 6,49 | 7.5,59.5 CONN3.P$6 | 7.5,59.5 7,59.5 6,49 | JP6.2 8,68.22 8,65 7.5,64.5 7.5,59.5
INPUT_PANEL3
  Top 1.016: 83,30 83,17.4 R112.1 87.42,16.4 JP8.1 JP8.2 | 83,30 82.75,30.25 CONN4.P$6 | CONN4.P$1 81.75,38 83,38 83,30
LDO_3V3_BYP2
  Top 0.61: U5.P$4 5.76,77.75 C9.2
LDO_5V_BYP2
  Top 0.61: U7.P$4 84.15,76.83 C15.2
LOAD1
  Top 0.203: R37.2 22.25,17.7 22.25,17 R36.2
  Top 1.016: R37.2 21.73,18.22 U$10.A
LOAD2
  Top 0.203: R83.2 46.25,17.7 46.25,17 R82.2
  Top 1.016: R83.2 45.73,18.22 U$19.A
LOAD3
  Top 0.203: R111.2 70.25,17.7 70.25,17 R110.2
  Top 1.016: R111.2 69.73,18.22 U$25.A
N$1
  Top 0.2: R5.1 C4.2
  Top 0.203: U$9.G 21.85,6.9 R5.1 | C4.2 22.95,9.1 R6.1
N$2
  Top 0.203: U$5.1 24.6,5.25 R7.2 24.72,5 25.9,3.82 28.53,3.82 29.93,3.85 29.97,3.82 30.53,3.82 30.72,4 31.25,4 31.25,5.9 C5.1 30.15,7 R8.1
N$3
  Top 0.203: BLK1.P3.5_GPIO_DEBUG 76.32,68.67 76.32,70.55 | 76.32,70.55 79.05,73.28 U$3.8 | 76.32,70.55 76.5,70.73 D9.A
N$4
  Top 0.203: BLK1.P3.4_GPIO_DEBUG 76.82,68.67 76.82,69.5 78.06,70.74 U$3.7
N$5
  Top 0.203: BLK1.P2.1_RXD 82.15,68.6 U$3.4
N$6
  Top 0.203: U$5.3 25.45,8.95 26.5,10 26.5,10.15 R6.2
N$7
  Top 0.203: BLK1.P2.0_TXD 82.25,66.75 86,63 86,62 87.42,60.58 U$3.3
N$8
  Top 0.203: BLK1.SBWTDIO 81.45,66.25 85,62.7 85,59 85.96,58.04 U$3.2
N$9
  Top 0.203: BLK1.SBWTCK 81.25,65.75 84,63 84,58 86.5,55.5 U$3.SBWTCK
N$10
  Top 0.203: D1.C R1.1
N$11
  Top 0.203: D2.C R3.1
N$12
  Top 0.203: D3.C R4.1
N$13
  Top 0.203: D4.C 66.13,1.04 R9.1
N$14
  Top 0.2: R57.1 C39.2
  Top 0.203: U$16.G 45.85,6.9 R57.1 | C39.2 46.95,9.1 R58.1
N$15
  Top 0.203: U$15.1 48.6,5.25 R59.2 48.72,5 49.9,3.82 52.53,3.82 53.93,3.85 53.97,3.82 54.53,3.82 54.72,4 55.25,4 55.25,5.9 C40.1 54.15,7 R60.1
N$16
  Top 0.152: LT3652_DISABLE1.3 17.99,21.78 R22.1
  Top 0.203: U2.3 18.45,31.64 18.45,31.21 19.44,30.22 21.66,30.22 22.38,29.51 22.38,25.6 22.2,25.43 21.79,25.43 LT3652_DISABLE1.3
N$17
  Top 0.203: D8.C R26.2
N$18
  Top 0.203: D7.C 24.51,26.47 R25.2
N$19
  Top 0.203: U$15.3 49.45,8.95 50.5,10 50.5,10.15 R58.2
N$20
  Top 0.203: BLK1.P1.1_A1 70.75,56.25 71,56 71.03,56 71.13,55.89 73.01,55.89 C8.1 R14.2
N$21
  Top 0.203: D9.C R12.1
N$22
  Top 0.152: LT3652_DISABLE3.3 41.99,21.78 R66.1
  Top 0.203: U3.3 42.45,31.64 42.45,31.21 43.44,30.22 45.66,30.22 46.38,29.51 46.38,25.6 46.2,25.43 45.79,25.43 LT3652_DISABLE3.3
N$23
  Top 0.203: D13.C R70.2
N$24
  Top 0.203: D12.C 48.51,26.47 R69.2
N$25  (1 unrouted)
  Top 0.203: D14.C 20,1
N$27
  Top 0.203: D5.C R10.1
N$28
  Top 0.2: R85.1 C58.2
  Top 0.203: U$22.G 66.6,6.65 R85.1 | C58.2 67.7,8.85 R86.1
N$29
  Top 0.203: U$21.1 69.35,5 R87.2 69.47,4.75 70.65,3.57 73.28,3.57 74.68,3.6 74.72,3.57 75.28,3.57 75.47,3.75 76,3.75 76,5.65 C59.1 74.9,6.75 R88.1
N$30
  Top 0.203: U$21.3 70.2,8.7 71.25,9.75 71.25,9.9 R86.2
N$31
  Top 0.152: LT3652_DISABLE4.3 65.99,21.78 R94.1
  Top 0.203: U4.3 66.45,31.64 66.45,31.21 67.44,30.22 69.66,30.22 70.38,29.51 70.38,25.6 70.2,25.43 69.79,25.43 LT3652_DISABLE4.3
N$32
  Top 0.203: D18.C R98.2
N$33
  Top 0.203: D17.C 72.51,26.47 R97.2
N$34
  Top 0.203: BLK1.P1.2_A2 71.25,56.35 71.3,56.3 76.03,56.3 76.91,55.43 76.91,55.2 C12.1 R24.2
N$36
  Top 0.203: 80.07,54.48 79.11,54.48 79.07,54.52
N$37
  Top 0.203: BLK1.P1.0_A0 70.25,55.15 C3.1 R13.2
N$38
  Top 0.203: 48.87,59.74 49.13,59.48 52.5,59.48
N$39  (via drill 0.35)
  other vias: 55.47,73.03
N$40
  Top 0.203: 55.57,73.1 55.26,72.79 55.26,71.94
OUT1  (via drill 0.35)
  Top 0.2: C4.1 20.71,10.9 U$9.D1
  Top 0.203: R37.1 22.25,14.3 22.25,15 25.25,15 25.33,14.92 R35.2 | U$9.D2 15.8,10.8 v15,10 | v14,1 D14.A
  Route3 0.203: v15,10 14,9 v14,1
  pour Top (no thermals): 16.5,10 16.5,12 22.5,14 22.5,10.75
OUT2  (via drill 0.35)
  Top 0.2: C39.1 44.71,10.9 U$16.D1
  Top 0.203: R83.1 46.25,14.3 46.25,15 49.25,15 49.33,14.92 R81.2 | D5.A v39,1 | v39,8 42,8 42,8.19 U$16.D1
  Route3 0.203: v39,1 v39,8
  pour Top (no thermals): 40.5,10 40.5,12 46.5,14 46.5,10.75
OUT3  (1 unrouted)
  Top 0.2: C58.1 65.46,10.65 U$22.D1
  Top 0.203: R111.1 70.25,14.3 70.25,15 73.25,15 73.33,14.92 R109.2 | D4.A 59,3.4 59,5 62.5,8.5
  pour Top (no thermals): 61.25,9.75 61.25,11 67,12.5 68.5,14.25 70.75,14.25 67.5,10.25
OUTPUT1
  Top 0.203: U$8.C 28.33,30.97 R17.2
  Top 1.016: U$8.C 29.86,31.45 | 29.86,31.45 C25.1 | 29.86,31.45 29.86,34.42 30.26,34.82 30.26,43.86 29,45.11 29,49 28.31,49 27.89,49.41 19.59,49.41 17,52 17,57.76 JP1.1
OUTPUT2  (1 unrouted)
  Top 0.203: U$18.C 52.33,30.97 R61.2
  Top 1.016: U$18.C 53.86,31.45 | 53.86,31.45 C49.1 | 53.86,31.45 53.86,34.42 54.26,34.82 54.26,43.86 53,45.11 53,49 52.31,49 50.67,50.63 20.09,50.63 19.6,51.12 19.6,57.7
OUTPUT3  (1 unrouted)
  Top 0.203: U$24.C 76.33,30.97 R89.2
  Top 1.016: U$24.C 77.86,31.45 | 77.86,31.45 C68.1 | 77.86,31.45 77.86,34.42 78.26,34.82 78.26,43.86 76.64,45.48 76.64,48.67 76.14,49.16 67.5,49.16 67.09,48.75 54.75,48.75 54.22,49.28 54.22,49.51 51.88,51.85 22.91,51.85 22.14,52.62 22.14,57.7
POWER_OUT
  pour Top: 16,60 23,70 23,85 32,85 32,72 23,60
SCL  (via drill 0.35)  (7 unrouted)
  Top 0.203: R16.2 32,20.39 32.2,20.39 32.62,19.97 32.62,17.61 32.28,17.27 U$4.5 | R74.2 56,20.39 56.2,20.39 56.62,19.97 56.62,17.61 56.28,17.27 U$20.5 | R102.2 80,20.39 80.2,20.39 80.62,19.97 80.62,17.61 80.28,17.27 U$26.5 | JP5.3 45.02,75.63 45.02,77.4 45.75,78.12 69.65,78.12 69.77,78 70,78 70.42,77.58 70.42,76.36 73.25,73.54 BLK1.P5.1_I2C-SCL-1
  Route3 0.203: JP5.3 32.43,62.53 JP5.2 | 32.43,57.95 JP5.1 32.17,56.07 30.84,54.74 30.84,22.06 v31.4,21.5 32.1,20.8 50.92,20.8 51.22,20.51 51.78,20.51 52.72,21.45 52.72,21.7 53.12,22.1 53.69,22.1 54.99,20.8 55.16,20.8 | 55.16,20.8 74.92,20.8 75.22,20.51 75.87,20.51 77.12,21.76 79.16,21.76 79.4,22 79.4,21.91 v79.31,21.41 | 55.16,20.8 55.16,21.46 55.3,21.6 55.3,21.8 v55.41,21.41
SDA  (via drill 0.35)  (6 unrouted)
  Top 0.203: U$4.6 31.63,18.17 32.22,18.75 32.22,19.8 32.04,19.98 30.5,19.98 v29.41,21.38 28.93,21.07 | U$20.6 55.63,18.17 56.22,18.75 56.22,19.8 56.04,19.98 54.5,19.98 R73.2 52.93,21.07 | R101.2 78.5,19.98 80.04,19.98 80.22,19.8 80.22,18.75 79.63,18.17 U$26.6 | JP4.3 42.48,75.63 42.48,77.34 | 42.48,75.72 42.48,77.34 | 42.48,77.34 42.48,77.4 43.21,78.17 44.3,78.17 45.02,78.9 45.02,79.94 45.75,80.66 69.65,80.66 70.38,79.94 70.38,78.9 71.15,78.12 72.19,78.12 72.97,77.34 72.97,76.36 73.75,75.58 BLK1.P5.0_I2C-SDA-1
  Route3 0.203: 52.62,17.95 36.08,17.95 35.19,17.06 29.76,17.06 29.76,21.02 v29.41,21.38 29.76,22.14 29.76,26.79 30.43,27.47 30.43,56.9 JP4.1 29.89,57.95 | 52.62,17.95 60.65,17.95 61.54,17.06 75.48,17.06 77.4,18.98 77.4,21 77.41,21 R101.2 | 52.62,17.95 53.3,18.63 53.3,21.4 53.41,21.5 v53.41,21.41 | JP4.2 29.63,60.49 JP4.3
  other vias: 77.41,21.07
SENSE1
  pour Top (rank 6, no thermals): 18.15,36.38 18.1,36.62 15.1,40.35 15.05,45.9 23.05,45.9 23.1,37.95 18.5,36.5 18.5,36.3
SENSE2
  pour Top (rank 6, no thermals): 42.15,36.38 42.1,36.62 39.1,40.35 39.05,45.9 47.05,45.9 47.1,37.95 42.5,36.5 42.5,36.3
SENSE3
  pour Top (rank 6, no thermals): 66.15,36.38 66.1,36.62 63.1,40.35 63.05,45.9 71.05,45.9 71.1,37.95 66.5,36.5 66.5,36.3
SW1
  pour Top (rank 2, no thermals): 17.1,35.65 15.3,35.65 13.6,33.95 10.9,33.95 10.9,45.85 15.1,45.85 15.1,37.05 16,36.35 17.1,36.35
SW2
  pour Top (rank 2, no thermals): 41.1,35.65 39.3,35.65 37.6,33.95 34.9,33.95 34.9,45.85 39.1,45.85 39.1,37.05 40,36.35 41.1,36.35
SW3
  pour Top (rank 2, no thermals): 65.1,35.65 63.3,35.65 61.6,33.95 58.9,33.95 58.9,45.85 63.1,45.85 63.1,37.05 64,36.35 65.1,36.35
SYNC1  (via drill 0.35)
  Top 0.203: v44,66 v46.5,66 | v54.5,66 v56.25,66 | v56.25,66 56.5,66 v56.25,66 | v82,61.46 80.64,61.46 80.5,61.32 80.4,61.32 80.32,61.24 BLK1.P7.2_SYNC1
  Route3 0.203: U$1.P$45 44,74.07 v44,66 | v46.5,66 v54.5,66 | v56.25,66 61.12,61.14 70.1,61.14 71.05,62.09 75.45,62.09 75.54,62 81.5,62 82,61.5 v82,61.46
SYNC2  (via drill 0.35)
  Top 0.203: v82,60.5 81.75,60.75 BLK1.PJ.3_SYNC2
  Route3 0.203: v82,60.5 76.47,60.5 75.28,61.68 71.22,61.68 70.03,60.5 54.49,60.5 52.81,58.83 52.25,58.83 45.32,65.76 45.32,75.29 U$1.P$49
TEMP1  (via drill 0.35)
  Top 0.203: CONN1.P$4 v9.5,35 | R13.1 71.67,53.1 70.28,51.72 69.72,51.72 68.27,53.16 49.11,53.16 48.99,53.19 48.95,53.22 48.94,53.23 48.88,53.24 48.42,53.24 48.26,53.24 48.25,53.25 48.24,53.25 48.13,53.37 48.02,53.48 44.8,56.88 43.62,56.88 v37,63.5
  Route3 0.203: v9.5,35 9,35.5 7,35.5 7,50.03 10.43,52.97 10.43,58.43 15,63 28.34,63 29.19,63.85 32.62,63.85 32.96,63.5 v37,63.5
TEMP2  (via drill 0.35)
  Top 0.203: CONN3.P$4 v9.5,56.5 | v38.5,63.5 38.5,62.58 43.79,57.29 44.99,57.29 48.42,53.65 48.9,53.65 49.16,53.59 69.06,53.59 69.27,53.8 75.3,53.8 R14.1
  Route3 0.203: v9.5,56.5 9.5,56.78 8.57,57.72 8.57,58.28 14.54,64.25 37.21,64.25 37.97,63.5 v38.5,63.5 39,63.5
TEMP3  (via drill 0.35)
  Top 0.203: R24.1 81.9,39.38 82.47,38.81 83.34,38.81 84.3,37.85 v84.3,33.6 | v80.6,33.21 81.46,33.21 CONN4.P$4
  Route3 0.203: v84.3,33.6 83.9,33.2 80.5,33.2 80.51,33.21 v80.6,33.21
VBAT
  Top 0.203: 33.5,84.57 U$1.P$36 U$1.P$35 33.5,82.03 33.5,84.57 | 33.5,84.57 33.5,86.5 | 33.5,86.5 11.5,86.5 11.18,86.18 11.18,80.79 10.15,79.76 C10.2 | 33.5,86.5 78.5,86.5 78.46,85.46 78.46,81.94 78.52,81.88 78.52,81.8 78.53,81.79 78.53,81.14 79.43,80.24 C16.2
  Top 0.254: U5.P$3 | C10.2 9.91,79.11 | U7.P$1
  Top 0.508: U5.P$1
  Top 0.61: U5.P$3 8.56,77.75 8.56,75.85 U5.P$1 | 9.91,79.11 U5.P$3 | U7.P$1 81.28,78.73 81.28,76.83 81.27,76.83 U7.P$3 | U7.P$1 79.92,79.38 C16.2
VFB1
  Top 0.203: U2.7 21.71,35.98 C26.2 22.7,35.15 26.83,35.15 26.83,34.83 26.84,34.95 26.84,33.79 25.83,32.78 R17.1 25.78,32.82 R18.2
VFB2
  Top 0.203: U3.7 45.71,35.98 C50.2 46.7,35.15 50.83,35.15 50.83,34.83 50.84,34.95 50.84,33.79 49.83,32.78 R61.1 49.78,32.82 R62.2
VFB3
  Top 0.203: U4.7 69.71,35.98 C69.2 70.7,35.15 74.83,35.15 74.83,34.83 74.84,34.95 74.84,33.79 73.83,32.78 R89.1 73.78,32.82 R90.2
VIN1
  Top 0.203: D8.A D7.A | 20.53,25.49 D7.A | R22.2 16.91,24.39 | D7.A 20.53,25.49 | 20.53,25.49 20.53,25.27 20.13,24.87 19.57,24.87 19.43,25 15.5,25 15,25.5
  Top 1.016: U$10.C 17.77,13.76 C28.1
  pour Top (no thermals): 17.15,31.5 16.85,31.5 16.85,31.35 16.25,30.75 15.75,30.75 13.75,29.2 13.75,12.75 15.6,12.75 15.57,21.89 15.83,23.15 16.75,23.15 18.75,25.45 17.9,26.3 17.9,27.35 18.75,28.2 18.75,30.25 17.9,31.1 17.4,31.1 17.2,31.3 17.2,31.4
VIN2
  Top 0.203: D13.A D12.A | D12.A 44.53,25.49 | R66.2 40.91,24.39 43.66,24.39 44.53,25.27 44.53,25.49 | D12.A 44.53,25.49
  Top 1.016: U$19.C 41.77,13.76 C52.1
  pour Top (no thermals): 41.15,31.5 40.85,31.5 40.85,31.35 40.25,30.75 39.75,30.75 37.75,29.2 37.75,12.75 39.6,12.75 39.57,21.89 39.83,23.15 40.75,23.15 42.75,25.45 41.9,26.3 41.9,27.35 42.75,28.2 42.75,30.25 41.9,31.1 41.4,31.1 41.2,31.3 41.2,31.4
VIN3
  Top 0.203: D18.A D17.A 68.53,25.49 68.53,25.27 68.13,24.87 67.57,24.87 67.43,25 63.5,25 63.02,25.48 C66.1 | 64.91,24.39 R94.2
  Top 1.016: U$25.C 65.77,13.76 C71.1
  pour Top (no thermals): 65.15,31.5 64.85,31.5 64.85,31.35 64.25,30.75 63.75,30.75 61.75,29.2 61.75,12.75 63.6,12.75 63.57,21.89 63.83,23.15 64.75,23.15 66.75,25.45 65.9,26.3 65.9,27.35 66.75,28.2 66.75,30.25 65.9,31.1 65.4,31.1 65.2,31.3 65.2,31.4
VIN_REG1
  Top 0.203: R21.2 17.89,26.89 R20.1 19.66,29.35 17.8,31.21 17.8,31.64 U2.2
VIN_REG2
  Top 0.203: R65.2 41.89,26.89 R64.1 43.66,29.35 41.8,31.21 41.8,31.64 U3.2
VIN_REG3
  Top 0.203: R93.2 65.89,26.89 R92.1 67.66,29.35 65.8,31.21 65.8,31.64 U4.2